# Altium schematic sheet 1_Processor.SchDoc
size A3; Organization: Altium Limited; Address1: L3, 12a Rodborough Rd; Address2: Frenchs Forest; Address3: NSW; Address4: Australia 2086; SheetNumber: 1; SheetTotal: 8
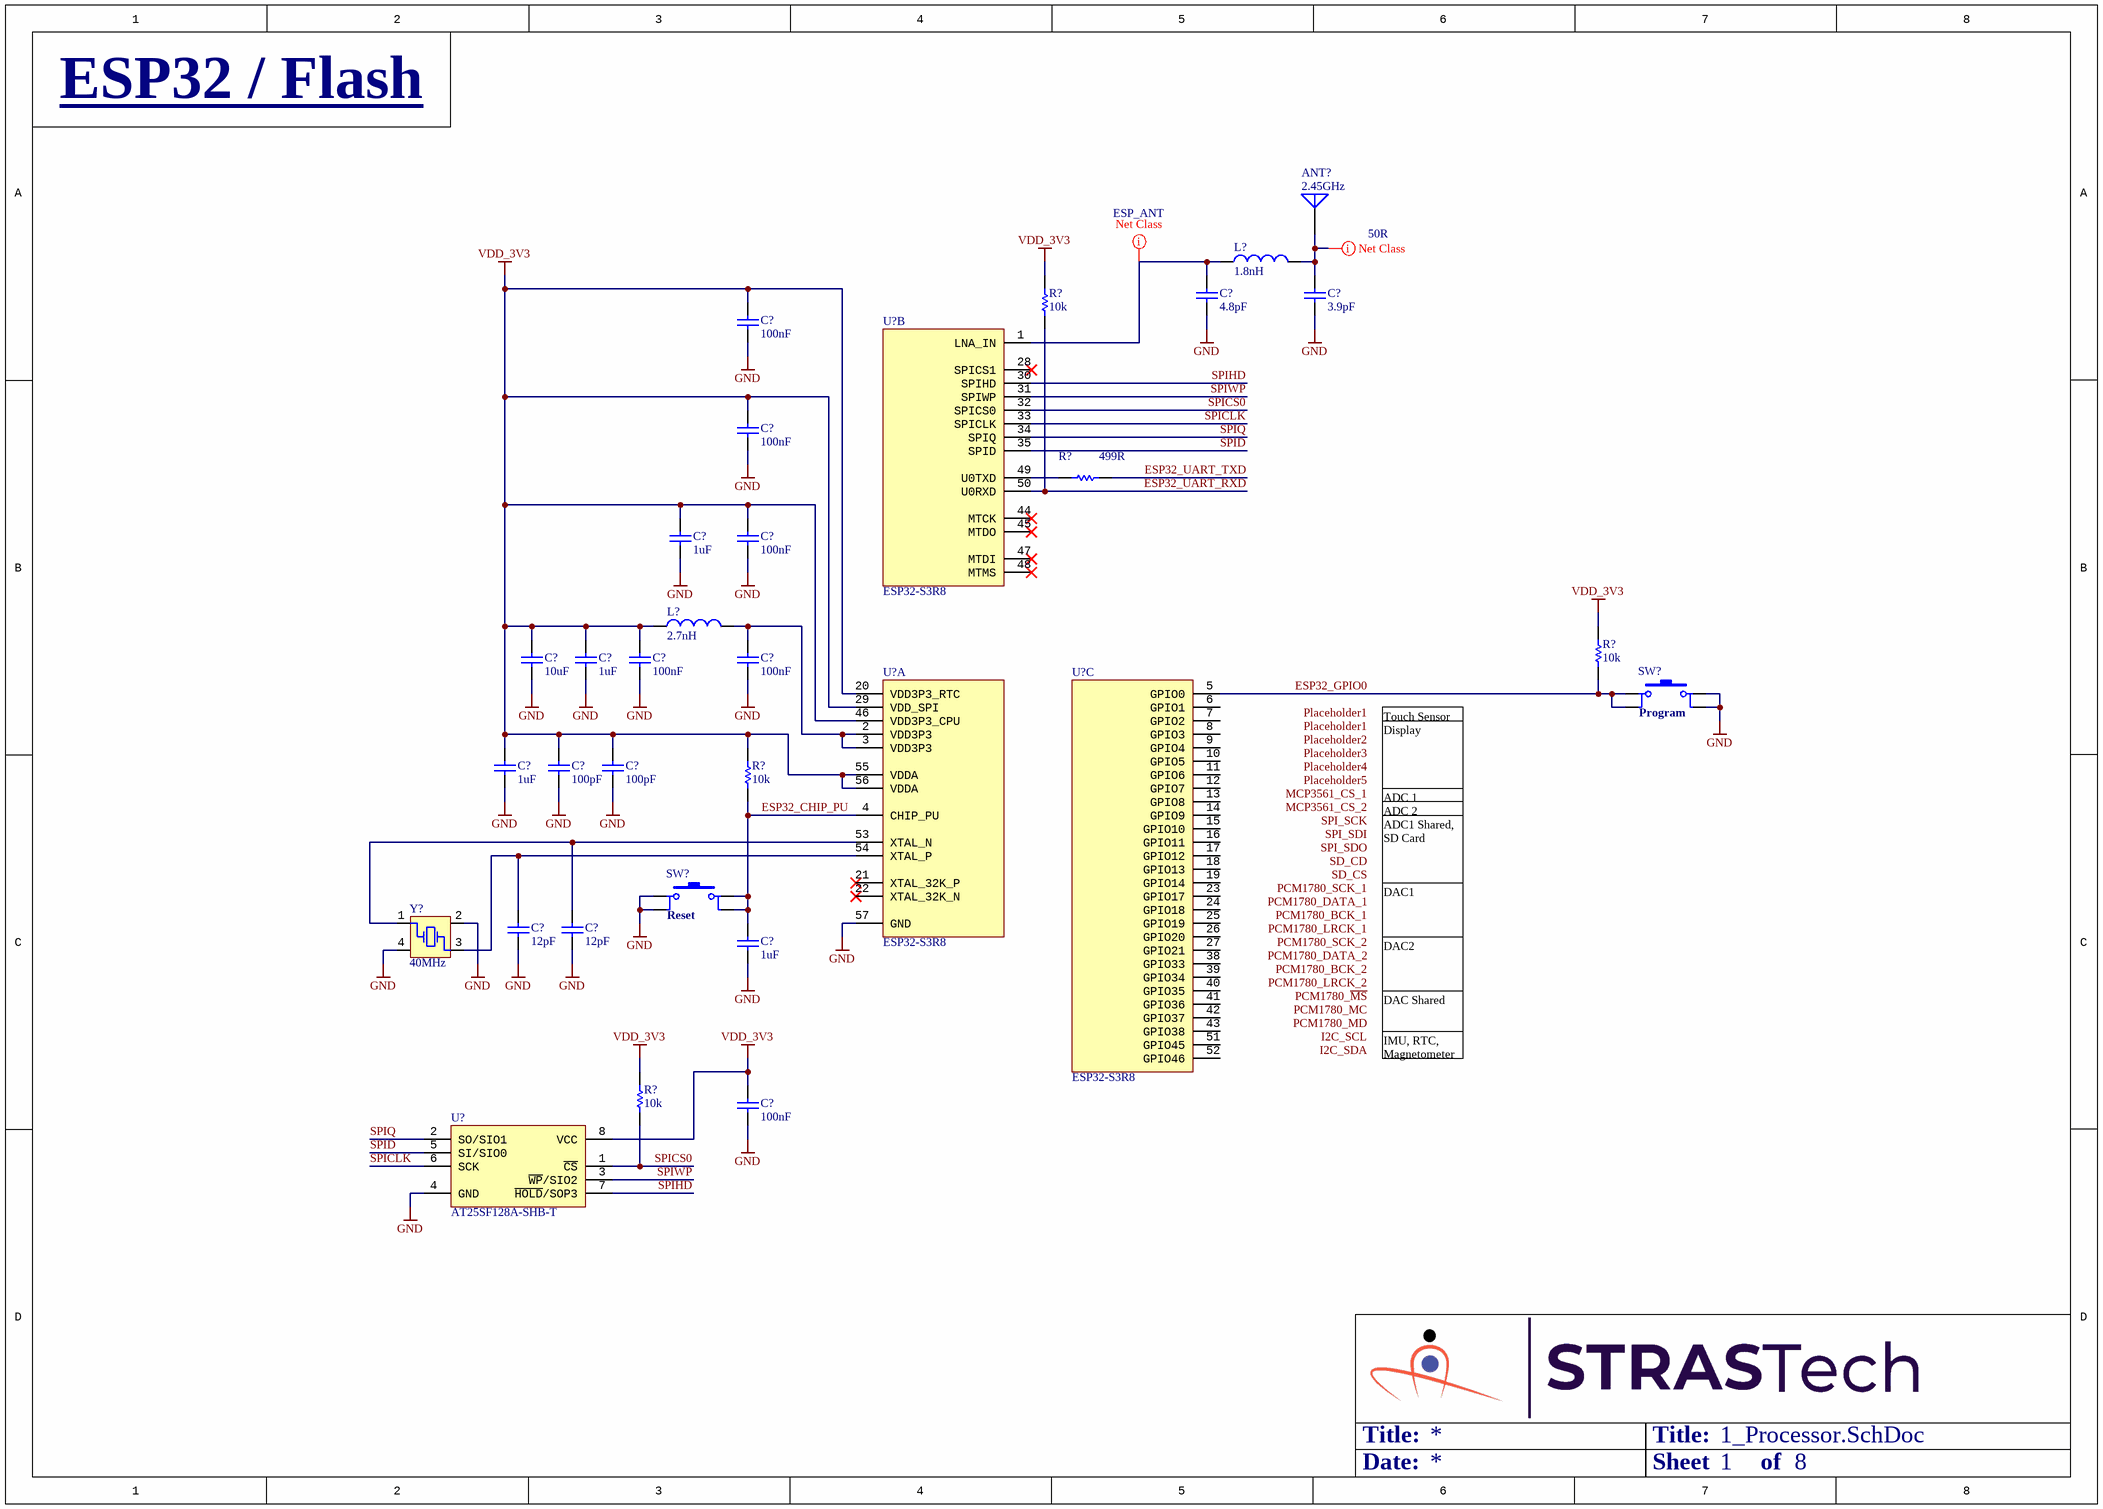
[diagram p0: 1_Processor.SchDoc]

## Parts
(Parts that share a designator on the sheet are numbered #1, #2 ... from top to bottom, then left to right.)
ANT?  2.45GHz  [ANT,PCB,IFA,2.45GHZ]
C?#1  4.8pF  [Cap,SMD,0402]
C?#2  3.9pF  [Cap,SMD,0402]
C?#3  100nF  [Cap,SMD,0402]
C?#4  100nF  [Cap,SMD,0402]
C?#5  1uF  [Cap,SMD,0402]
C?#6  100nF  [Cap,SMD,0402]
C?#7  10uF  [Cap,SMD,0402]
C?#8  1uF  [Cap,SMD,0402]
C?#9  100nF  [Cap,SMD,0402]
C?#10  100nF  [Cap,SMD,0402]
C?#11  1uF  [Cap,SMD,0402]
C?#12  100pF  [Cap,SMD,0402]
C?#13  100pF  [Cap,SMD,0402]
C?#14  12pF  [Cap,SMD,0402]
C?#15  12pF  [Cap,SMD,0402]
C?#16  1uF  [Cap,SMD,0402]
C?#17  100nF  [Cap,SMD,0402]
L?#1  1.8nH  [ind,0402]
L?#2  2.7nH  [ind,0402]
R?#1  10k  [RES,0402]
R?#2  499R  [RES,0402]
R?#3  10k  [RES,0402]
R?#4  10k  [RES,0402]
R?#5  10k  [RES,0402]
SW?#1  Switch  [Switch,Tactile,Micro,SPST-NO,SMD]  (value not drawn)
SW?#2  Switch  [Switch,Tactile,Micro,SPST-NO,SMD]  (value not drawn)
U?#1  ESP32-S3R8  [IC,QFN-56,7X7,P0.4MM]  (part B of 3)
U?#2  ESP32-S3R8  [IC,QFN-56,7X7,P0.4MM]  (part A of 3)
U?#3  ESP32-S3R8  [IC,QFN-56,7X7,P0.4MM]  (part C of 3)
U?#4  AT25SF128A-SHB-T  [IC,SOIC-8,1.27mm,W3.9]
Y?  40MHz  [XTAL,SMD,4 Pin,2x2.5mm]

## Nets
GND: C?#1.1 C?#2.1 C?#3.1 C?#4.1 C?#5.1 C?#6.1 C?#7.1 C?#8.1 C?#9.1 C?#10.1 C?#11.1 C?#12.1 C?#13.1 C?#14.2 C?#15.2 C?#16.1 C?#17.1 SW?#1.3 SW?#1.4 SW?#2.1 SW?#2.2 U?#2.57(GND) U?#4.4(GND) Y?.2(GND) Y?.4(GND)
VDD_3V3: C?#3.2 C?#4.2 C?#5.2 C?#6.2 C?#7.2 C?#8.2 C?#9.2 C?#11.2 C?#12.2 C?#13.2 C?#17.2 L?#2.1 R?#1.2 R?#3.1 R?#4.1 R?#5.2 U?#2.20(VDD3P3_RTC) U?#2.29(VDD_SPI) U?#2.46(VDD3P3_CPU) U?#2.55(VDDA) U?#2.56(VDDA) U?#4.8(VCC)
ESP32_CHIP_PU: C?#16.2 R?#4.2 SW?#2.3 SW?#2.4 U?#2.4(CHIP_PU)
ESP32_GPIO0: R?#3.2 SW?#1.1 SW?#1.2 U?#3.5(GPIO0)
ESP32_UART_RXD: R?#1.1 U?#1.50(U0RXD)
ESP32_UART_TXD: R?#2.2
SPICLK: U?#1.33(SPICLK) U?#4.6(SCK)
SPICS0: R?#5.1 U?#1.32(SPICS0) U?#4.1(~{CS})
SPID: U?#1.35(SPID) U?#4.5(SI/SIO0)
SPIHD: U?#1.30(SPIHD) U?#4.7(~{HOLD}/SOP3)
SPIQ: U?#1.34(SPIQ) U?#4.2(SO/SIO1)
SPIWP: U?#1.31(SPIWP) U?#4.3(~{WP}/SIO2)
NetANT?_1: ANT?.1 C?#2.2 L?#1.2
NetC?#1_2: C?#1.2 L?#1.1 U?#1.1(LNA_IN)
NetC?#10_2: C?#10.2 L?#2.2 U?#2.2(VDD3P3) U?#2.3(VDD3P3)
NetC?#14_1: C?#14.1 U?#2.54(XTAL_P) Y?.3(OSC2)
NetC?#15_1: C?#15.1 U?#2.53(XTAL_N) Y?.1(OSC1)
NetR?#2_1: R?#2.1 U?#1.49(U0TXD)

Not connected (* = marked no-connect by the designer): U?#1 28(SPICS1)* 44(MTCK)* 45(MTDO)* 47(MTDI)* 48(MTMS)*; U?#2 21(XTAL_32K_P)* 22(XTAL_32K_N)*; U?#3 6(GPIO1) 7(GPIO2) 8(GPIO3) 9(GPIO4) 10(GPIO5) 11(GPIO6) 12(GPIO7) 13(GPIO8) 14(GPIO9) 15(GPIO10) 16(GPIO11) 17(GPIO12) 18(GPIO13) 19(GPIO14) 23(GPIO17) 24(GPIO18) 25(GPIO19) 26(GPIO20) 27(GPIO21) 38(GPIO33) 39(GPIO34) 40(GPIO35) 41(GPIO36) 42(GPIO37) 43(GPIO38) 51(GPIO45) 52(GPIO46)

## Layout directives
net class ESP_ANT: NetC?#1_2
net class 50R: NetANT?_1

## Notes on the sheet
- ESP32 / Flash
- Touch Sensor
- (near SW?#1) Program
- Display
- ADC 1
- ADC 2
- (near SW?#2) Reset
- ADC1 Shared, SD Card
- DAC2
- DAC1
- IMU, RTC, Magnetometer
- DAC Shared
- Title:
- Date:
- Sheet
- of
- Labels drawn without touching a wire or pin: I2C_SCL, I2C_SDA, MCP3561_CS_1, MCP3561_CS_2, PCM1780_BCK_1, PCM1780_BCK_2, PCM1780_DATA_1, PCM1780_DATA_2, PCM1780_LRCK_1, PCM1780_LRCK_2, PCM1780_MC, PCM1780_MD, PCM1780_SCK_1, PCM1780_SCK_2, PCM1780_~{MS}, Placeholder1, Placeholder2, Placeholder3, Placeholder4, Placeholder5, SD_CD, SD_CS, SPI_SCK, SPI_SDI, SPI_SDO
- Title
- Size:
- A3
- Revision:
- Design By:

## Library data of the parts
ANT? = ANT,2.45GHz,IFA,PCB: 2.4-GHz Inverted F Antenna; HelpURL: https://www.ti.com/lit/an/swru120d/swru120d.pdf?ts=1646240772720&ref_url=https%253A%252F%252Fwww.google.com%252F; CreatedBy: Judd Foster; Manufacturer: N/A; Manufacturer Part Number: N/A; Vendor: N/A; Vendor Part Number: N/A
C?#1 = CAP,Cer,4.8pF,50VDC,C0G/NP0,0402: 4.8 pF ±0.25pF 50V Ceramic Capacitor C0G, NP0 0402 (1005 Metric); Vendor Part Number: 490-17481-1-ND; Manufacturer: Murata Electronics; Manufacturer Part Number: GCQ1555C1H4R8CB01D; Vendor: Digikey; HelpURL: https://search.murata.co.jp/Ceramy/image/img/A01X/G101/ENG/GCQ1555C1H4R8CB01-01.pdf; CreatedBy: Judd Foster
C?#2 = CAP,Cer,3.9pF,50VDC,C0G/NP0,0402: 3.9 pF ±0.1pF 50V Ceramic Capacitor C0G, NP0 0402 (1005 Metric); Vendor Part Number: 399-CBR04C399B5GACCT-ND; Manufacturer: KEMET; Manufacturer Part Number: CBR04C399B5GAC; Vendor: Digikey; HelpURL: https://api.kemet.com/component-edge/download/datasheet/CBR04C399B5GAC.pdf; CreatedBy: Judd Foster
C?#3 C?#4 C?#6 C?#9 C?#10 C?#17 = CAP,Cer,100nF,25VDC,X7R,0402: 0.1µF ±10% 25V Ceramic Capacitor X7R 0402 (1005 Metric); Vendor Part Number: 490-14603-1-ND; Manufacturer: Murata Electronics; Manufacturer Part Number: GRM155R71E104KE14J; Vendor: Digikey; HelpURL: https://search.murata.co.jp/Ceramy/image/img/A01X/G101/ENG/GRM155R71E104KE14-01.pdf; CreatedBy: Judd Foster
C?#5 C?#8 C?#11 = CAP,Cer,1uF,35VDC,X5R,0402: 1 µF ±10% 35V Ceramic Capacitor X5R 0402 (1005 Metric); Vendor Part Number: 445-9073-1-ND; Manufacturer: TDK Corporation; Manufacturer Part Number: C1005X5R1V105K050BC; Vendor: Digikey; HelpURL: https://product.tdk.com/info/en/catalog/datasheets/mlcc_commercial_general_en.pdf?ref_disty=digikey; CreatedBy: Judd Foster
C?#7 = CAP,Cer,10uF,10VDC,X5R,0402: 10 µF ±20% 10V Ceramic Capacitor X5R 0402 (1005 Metric); Vendor Part Number: 1276-1450-1-ND; Manufacturer: Samsung Electro-Mechanics; Manufacturer Part Number: CL05A106MP5NUNC; Vendor: Digikey; HelpURL: https://media.digikey.com/pdf/Data%20Sheets/Samsung%20PDFs/CL05A106MP5NUNC_Spec.pdf; CreatedBy: Judd Foster
C?#12 C?#13 = CAP,Cer,100pF,50VDC,C0G/NP0,0402: 100pF ±5% 50V Ceramic Capacitor C0G, NP0 0402 (1005 Metric); Vendor Part Number: 490-10669-1-ND; Manufacturer: Murata Electronics; Manufacturer Part Number: GCM1555C1H101JA16D; Vendor: Digikey; HelpURL: https://www.murata.com/~/media/webrenewal/support/library/catalog/products/capacitor/mlcc/c03e.ashx?la=en-us; CreatedBy: Judd Foster
C?#14 C?#15 = CAP,Cer,12pF,50VDC,C0G/NP0,0402: 12pF ±5% 50V Ceramic Capacitor C0G, NP0 0402 (1005 Metric); Vendor Part Number: 311-1016-1-ND; Manufacturer: Yageo; Manufacturer Part Number: CC0402JRNPO9BN120; Vendor: Digikey; HelpURL: https://www.yageo.com/upload/media/product/productsearch/datasheet/mlcc/UPY-GP_NP0_16V-to-50V_18.pdf; CreatedBy: Judd Foster
C?#16 = CAP,Cer,1uF,6.3VDC,X5R,0402: 1µF ±20% 6.3V Ceramic Capacitor X5R 0402 (1005 Metric); Vendor Part Number: 1276-1235-1-ND; Manufacturer: Samsung Electro-Mechanics; Manufacturer Part Number: CL05A105MQ5NNNC; Vendor: Digikey; HelpURL: https://media.digikey.com/pdf/Data%20Sheets/Samsung%20PDFs/CL_Series_MLCC_ds.pdf; CreatedBy: Judd Foster
L?#1 = IND,1.8nH,900mA,Multilayer,0402: 1.8 nH Unshielded Multilayer Inductor 900 mA 100mOhm Max 0402 (1005 Metric); Vendor Part Number: 490-1076-1-ND; Manufacturer: Murata Electronics; Manufacturer Part Number: LQG15HN1N8S02D; Vendor: Digikey; HelpURL: https://search.murata.co.jp/Ceramy/image/img/P02/JELF243B-0009.pdf; CreatedBy: Judd Foster
L?#2 = IND,2.7nH,800mA,Multilayer,0402: 2.7nH Unshielded Multilayer Inductor 800mA 150mOhm Max 0402 (1005 Metric); Vendor Part Number: 490-2615-1-ND; Manufacturer: Murata Electronics; Manufacturer Part Number: LQG15HS2N7S02D; Vendor: Digikey; HelpURL: https://psearch.en.murata.com/inductor/product/LQG15HS2N7S02_.pdf; CreatedBy: Judd Foster
R?#1 R?#3-R?#5 = RES,10k,5%,0.063W,0402: 10 kOhms ±5% 0.063W, 1/16W Chip Resistor 0402 (1005 Metric) Automotive AEC-Q200 Thick Film; Vendor Part Number: RMCF0402JT10K0CT-ND; Manufacturer: Stackpole Electronics Inc; Manufacturer Part Number: RMCF0402JT10K0; Vendor: DIgikey; HelpURL: https://www.seielect.com/catalog/sei-rmcf_rmcp.pdf; CreatedBy: Judd Foster
R?#2 = RES,499R,1%,0.063W,0402: 499 Ohms ±1% 0.063W, 1/16W Chip Resistor 0402 (1005 Metric) Automotive AEC-Q200 Thick Film; Manufacturer: Stackpole Electronics Inc; Manufacturer Part Number: RMCF0402FT499R; Vendor Part Number: RMCF0402FT499RCT-ND; Vendor: Digikey; CreatedBy: Judd Foster; HelpURL: https://www.seielect.com/catalog/sei-rmcf_rmcp.pdf
SW?#1 SW?#2 = Switch,Tactile,SPST-NO,SMD,H1.5: Tactile Switch SPST-NO Top Actuated Surface Mount; Manufacturer: C&K; Manufacturer Part Number: PTS525SM15SMTR2 LFS; Vendor Part Number: CKN9104CT-ND; Vendor: Digikey; CreatedBy: Judd Foster; HelpURL: https://www.ckswitches.com/media/1467/pts525.pdf
U?#1-U?#3 = ESP32-S3R8: IC RF TxRx + MCU Bluetooth, WiFi 802.11b/g/n, Bluetooth v5.0 2.412GHz ~ 2.484GHz 56-VFQFN Exposed Pad; Manufacturer: Espressif Systems; Vendor Part Number: 1904-ESP32-S3R8-ND; Vendor: Digikey; CreatedBy: Judd Foster; HelpURL: https://www.espressif.com/sites/default/files/documentation/esp32-s3_datasheet_en.pdf; Manufacturer Part Number: ESP32-S3R8
U?#4 = AT25SF128A-SHB-T: FLASH - NOR Memory IC 128Mb (16M x 8) SPI - Quad I/O 133 MHz 8-SOIC; Manufacturer: Adesto Technologies; Vendor Part Number: 1265-1348-1-ND; Vendor: Digikey; CreatedBy: Judd Foster; HelpURL: https://www.dialog-semiconductor.com/sites/default/files/2021-02/DS-AT25SF128A-168.pdf; Manufacturer Part Number: AT25SF128A-SHB-T
Y? = XTAL,40MHz,12pF,SMD: 40 MHz ±7ppm Crystal 12pF 25 Ohms 4-SMD, No Lead; Manufacturer: Hosonic Electronic Co., Ltd; Manufacturer Part Number: E2SB40E000104E; Vendor Part Number: 3186-E2SB40E000104ECT-ND; Vendor: Digikey; CreatedBy: Judd Foster; HelpURL: https://ecsxtal.com/store/pdf/ECS-33B.pdf